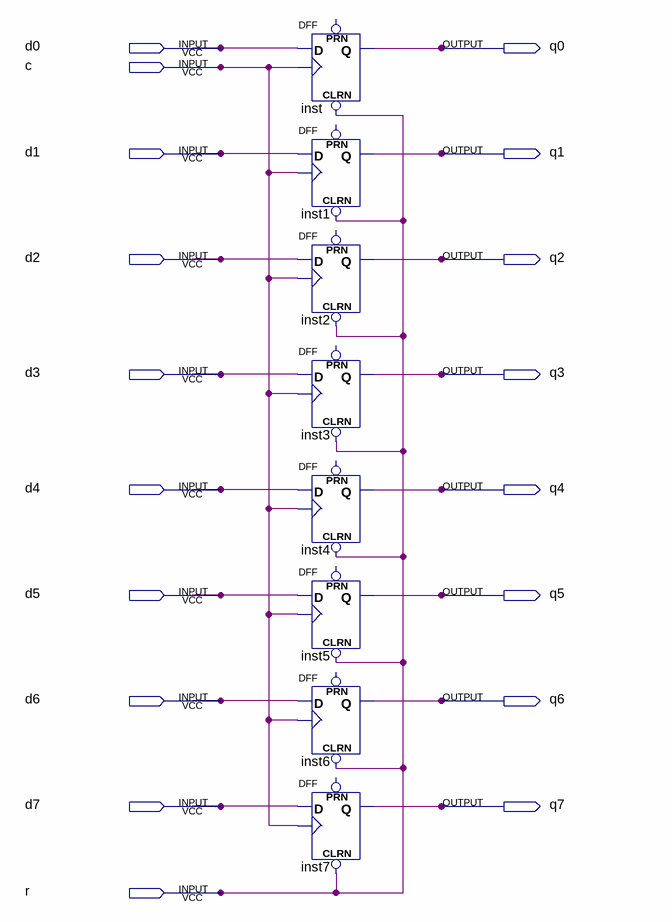
[diagram p0: schematic sheet]
// Quartus schematic laba1.bdf as structural Verilog: 8 symbols, 18 pins
module laba1 (
  input  d0,
  input  c,
  input  d1,
  input  d2,
  input  d3,
  input  d4,
  input  d5,
  input  d6,
  input  d7,
  input  r,
  output q0,
  output q1,
  output q2,
  output q3,
  output q4,
  output q5,
  output q6,
  output q7
);

  DFF inst (.CLRN(r), .CLK(c), .D(d0), .Q(q0));  // open: PRN
  DFF inst1 (.CLRN(r), .CLK(c), .D(d1), .Q(q1));  // open: PRN
  DFF inst2 (.CLRN(r), .CLK(c), .D(d2), .Q(q2));  // open: PRN
  DFF inst3 (.CLRN(r), .CLK(c), .D(d3), .Q(q3));  // open: PRN
  DFF inst4 (.CLRN(r), .CLK(c), .D(d4), .Q(q4));  // open: PRN
  DFF inst5 (.CLRN(r), .CLK(c), .D(d5), .Q(q5));  // open: PRN
  DFF inst6 (.CLRN(r), .CLK(c), .D(d6), .Q(q6));  // open: PRN
  DFF inst7 (.CLRN(r), .CLK(c), .D(d7), .Q(q7));  // open: PRN
endmodule
